# Altium schematic sheet Motor_Driver.SchDoc
size A; SheetNumber: 5; SheetTotal: 6
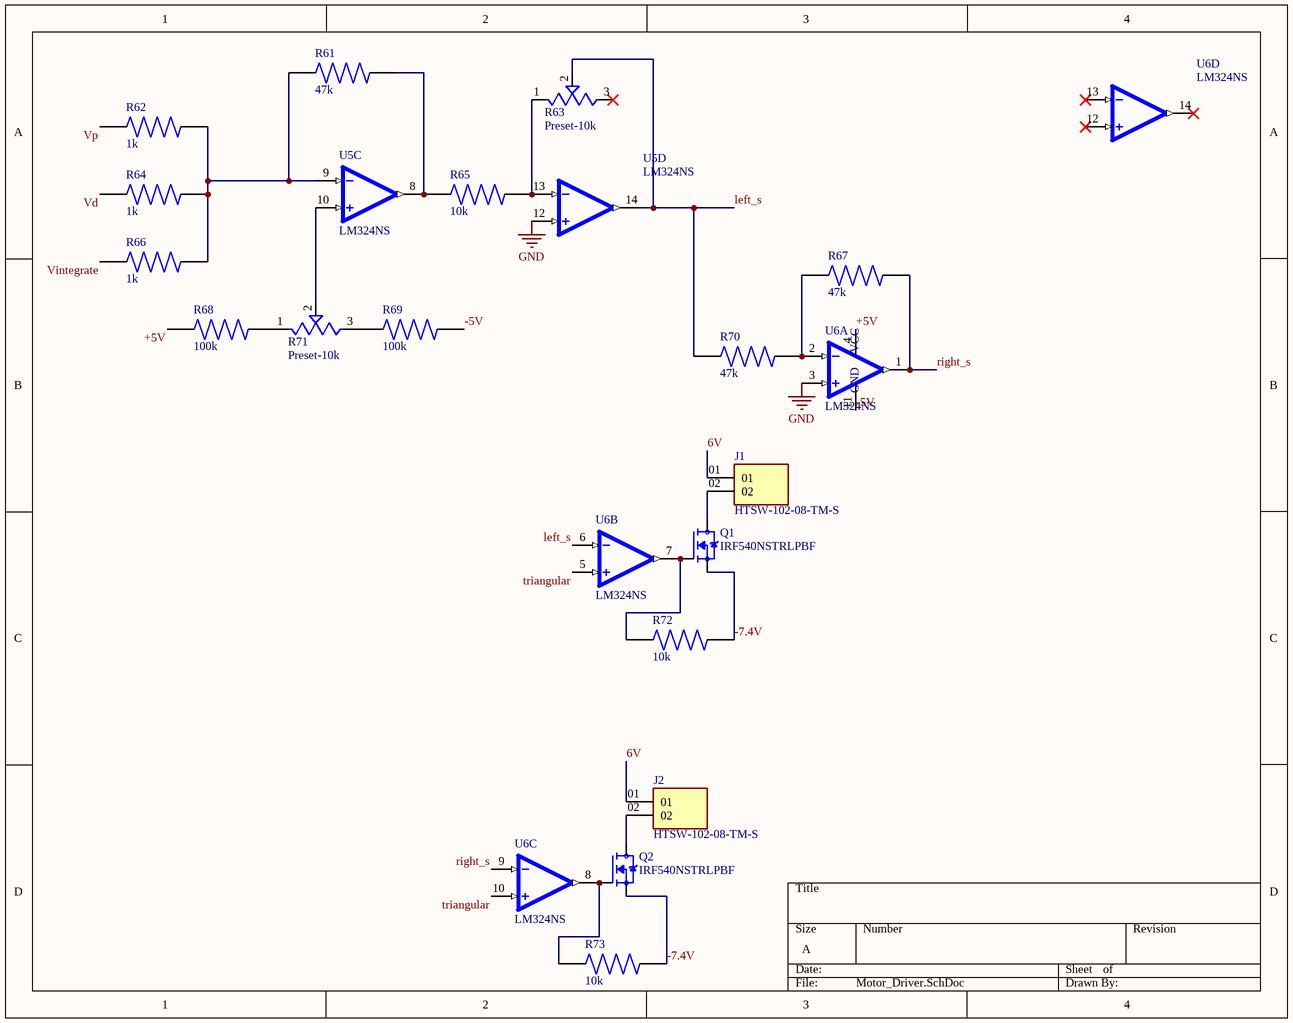
[diagram p0: Motor_Driver.SchDoc]

## Parts
J1  HTSW-102-08-TM-S  [SAMTEC_HTSW-102-08-TM-S]
J2  HTSW-102-08-TM-S  [SAMTEC_HTSW-102-08-TM-S]
Q1  IRF540NSTRLPBF  [TRANS_IRF540NSTRLPBF]
Q2  IRF540NSTRLPBF  [TRANS_IRF540NSTRLPBF]
R61  47k  [RESC2012X60N]
R62  1k  [RESC2012X60N]
R63  Preset-10k  [TRIM_3306F-1-103]
R64  1k  [RESC2012X60N]
R65  10k  [RESC2012X60N]
R66  1k  [RESC2012X60N]
R67  47k  [RESC2012X60N]
R68  100k  [RESC2012X60N]
R69  100k  [RESC2012X60N]
R70  47k  [RESC2012X60N]
R71  Preset-10k  [TRIM_3306F-1-103]
R72  10k  [RESC2012X60N]
R73  10k  [RESC2012X60N]
U5  LM324NS  [SOIC127P780X200-14N]  (parts C,D of 4)
U6  LM324NS  [SOIC127P780X200-14N]  (parts A,B,C,D of 4)

## Nets
GND: U5.12(4IN+) U6.3(1IN+)
6V: J1.01 J2.01
+5V: R68.1 U6.4(VCC)
-5V: R69.2 U6.11(GND)
-7.4V: Q1.3(S) Q2.3(S) R72.2 R73.2
left_s: R63.2(W) R70.1 U5.14(4OUT) U6.6(2IN-)
right_s: R67.2 U6.1(1OUT) U6.9(3IN-)
triangular: U6.5(2IN+) U6.10(3IN+)
Vd: R64.1
Vintegrate: R66.1
Vp: R62.1
NetJ1_02: J1.02 Q1.2(D)
NetJ2_02: J2.02 Q2.2(D)
NetQ1_1: Q1.1(G) R72.1 U6.7(2OUT)
NetQ2_1: Q2.1(G) R73.1 U6.8(3OUT)
NetR61_1: R61.1 R62.2 R64.2 R66.2 U5.9(3IN-)
NetR61_2: R61.2 R65.1 U5.8(3OUT)
NetR63_1: R63.1(CCW) R65.2 U5.13(4IN-)
NetR67_1: R67.1 R70.2 U6.2(1IN-)
NetR68_2: R68.2 R71.1(CCW)
NetR69_1: R69.1 R71.3(CW)
NetR71_2: R71.2(W) U5.10(3IN+)

Not connected (* = marked no-connect by the designer): R63 3(CW)*; U6 12(4IN+)* 13(4IN-)* 14(4OUT)*

## Library data of the parts
J1 J2 = HTSW-102-08-TM-S: HEADER, 2 CONTACTS, 1 ROW, THROUGH HOLE, 2.54 MM; Connector Systems:Board-to-Board; Pitch Spacing:2.54mm; No. of Rows:1Rows; No. of Contacts:2Contacts; Contact Termination Type:Through Hole; Product Range:HTSW Series; Gender:Header RoHS Compliant: Yes; MP: HTSW10208TMS; MF: Samtec; Package: None; Value: *; SnapEDA_Link: https://www.snapeda.com/parts/HTSW10208TMS/Samtec/view-part/?ref=snap; Availability: In Stock; Price: None; Check_prices: https://www.snapeda.com/parts/HTSW10208TMS/Samtec/view-part/?ref=eda
Q1 Q2 = IRF540NSTRLPBF: MOSFET, Power,N-Ch,VDSS 100V,RDS(ON) 44 Milliohms,ID 33A,D2Pak,PD 130W,VGS+/-20V | Infineon IRF540NSTRLPBF; SnapEDA_Link: https://www.snapeda.com/parts/IRF540NSTRLPBF/Infineon/view-part/?ref=snap; Package: D2PAK Infineon; Value: *; MF: Infineon; MP: IRF540NSTRLPBF; Check_prices: https://www.snapeda.com/parts/IRF540NSTRLPBF/Infineon/view-part/?ref=eda
R61 R67 R70 = 47k: 47 kOhms Â±1% 0.125W, 1/8W Chip Resistor 0805 (2012 Metric) Moisture Resistant Thick Film; RC0805FR-0747KL; MF: Yageo; SnapEDA_Link: https://www.snapeda.com/parts/RC0805FR-0747KL/Yageo/view-part/?ref=snap; Package: 2012 Yageo; Value: *; MP: RC0805FR-0747KL; Check_prices: https://www.snapeda.com/parts/RC0805FR-0747KL/Yageo/view-part/?ref=eda
R62 R64 R66 = 1k: 1 kOhms Â±1% 0.125W, 1/8W Chip Resistor 0805 (2012 Metric) Moisture Resistant Thick Film; RC0805FR-071KL; MF: Yageo; DigiKey_Part_Number: 311-1.00KCRTR-ND; Purchase-URL: https://pricing.snapeda.com/search?q=RC0805FR-071KL&ref=eda; Package: 2012 Yageo; Check_prices: https://www.snapeda.com/parts/RC0805FR-071KL/Yageo/view-part/?ref=eda; Value: *; SnapEDA_Link: https://www.snapeda.com/parts/RC0805FR-071KL/Yageo/view-part/?ref=snap; MP: RC0805FR-071KL
R63 R71 = Preset: TRIMMER - 6MM ROUND, SINGLE-TURN,CERMET, 10K OHMS | Bourns 3306F-1-103; SnapEDA_Link: https://www.snapeda.com/parts/3306F-1-103/Bourns/view-part/?ref=snap; Package: 3306F Bourns; Value: *; MF: Bourns; MP: 3306F-1-103; Check_prices: https://www.snapeda.com/parts/3306F-1-103/Bourns/view-part/?ref=eda
R65 R72 R73 = 10k: 10 kOhms Â±1% 0.125W, 1/8W Chip Resistor 0805 (2012 Metric) Moisture Resistant Thick Film; RC0805FR-0710KL; MF: Yageo; Value: *; SnapEDA_Link: https://www.snapeda.com/parts/RC0805FR-0710KL/Yageo/view-part/?ref=snap; Purchase-URL: https://pricing.snapeda.com/search/part/RC0805FR-0710KL/?ref=eda; Availability: In Stock; Price: None; Package: 2012 Rohm Semiconductor; Check_prices: https://www.snapeda.com/parts/RC0805FR-0710KL/Yageo/view-part/?ref=eda; MP: RC0805FR-0710KL
R68 R69 = 100k: 100 kOhms Â±1% 0.125W, 1/8W Chip Resistor 0805 (2012 Metric) Moisture Resistant Thick Film; RC0805FR-07100KL; MF: Yageo; SnapEDA_Link: https://www.snapeda.com/parts/RC0805FR-07100KL/Yageo/view-part/?ref=snap; Package: 2012 Yageo; Value: *; MP: RC0805FR-07100KL; Check_prices: https://www.snapeda.com/parts/RC0805FR-07100KL/Yageo/view-part/?ref=eda
U5 U6 = LM324NS: 4-Channel industry standard operational amplifier 14-SO 0 to 70; LM324NSRG4; MF: Texas Instruments; Purchase-URL: https://pricing.snapeda.com/search/part/LM324NSRG4/?ref=eda; MP: LM324NSRG4; SnapEDA_Link: https://www.snapeda.com/parts/LM324NSRG4/Texas+Instruments/view-part/?ref=snap; Value: *; Package: SOP-14 Texas Instruments; Price: None; Availability: In Stock; Check_prices: https://www.snapeda.com/parts/LM324NSRG4/Texas+Instruments/view-part/?ref=eda